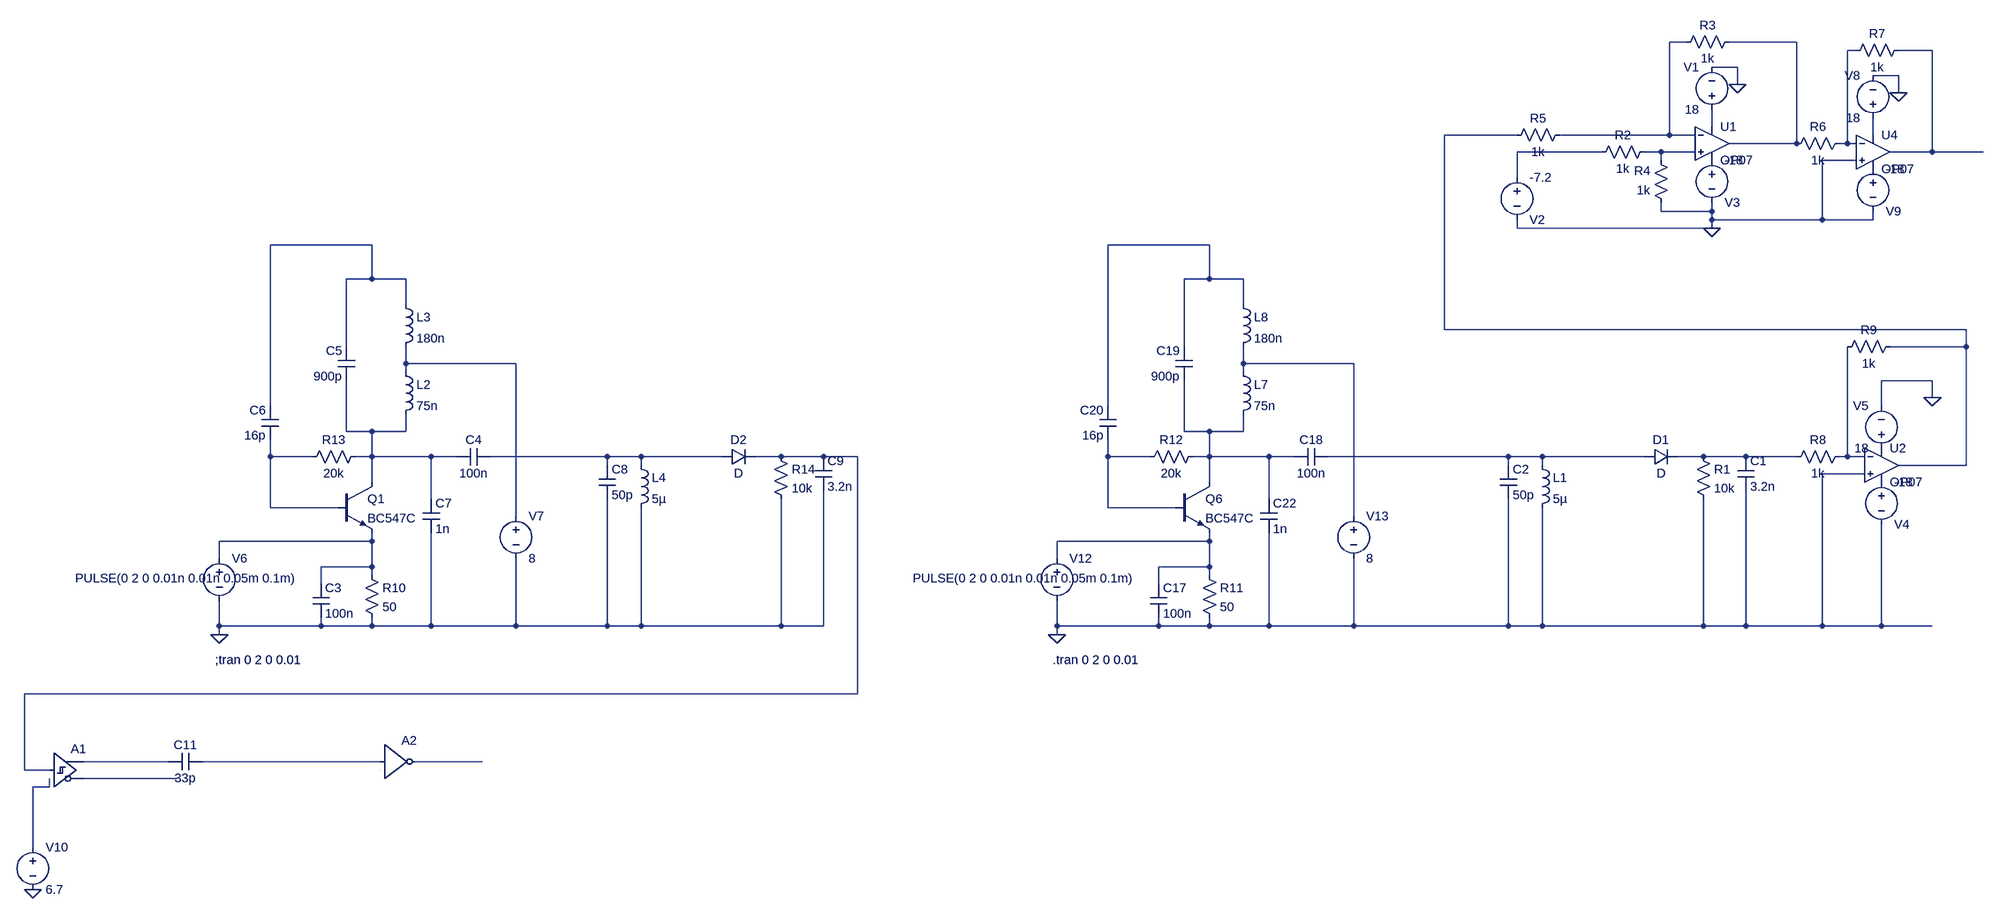
[diagram p0: schematic Empfaenger_Sender_Subtrahierer_Methode01und02.asc]
Empfaenger_Sender_Subtrahierer_Methode01und02.asc, the LTspice schematic file:
Version 4
SHEET 1 5860 1668
WIRE 1616 -80 1584 -80
WIRE 1824 -80 1696 -80
WIRE 1936 -64 1920 -64
WIRE 2080 -64 2016 -64
WIRE 1712 -32 1664 -32
WIRE 2016 -16 1968 -16
WIRE 1712 0 1712 -32
WIRE 2016 16 2016 -16
WIRE 1664 80 1664 48
WIRE 1296 96 1152 96
WIRE 1584 96 1584 -80
WIRE 1584 96 1376 96
WIRE 1632 96 1584 96
WIRE 1968 96 1968 64
WIRE 1824 112 1824 -80
WIRE 1824 112 1696 112
WIRE 1920 112 1920 -64
WIRE 1920 112 1904 112
WIRE 1936 112 1920 112
WIRE 1456 128 1296 128
WIRE 1568 128 1536 128
WIRE 1632 128 1568 128
WIRE 2080 128 2080 -64
WIRE 2080 128 2000 128
WIRE 2176 128 2080 128
WIRE 1568 144 1568 128
WIRE 1936 144 1872 144
WIRE 1296 176 1296 128
WIRE 1568 240 1568 224
WIRE 1664 240 1664 224
WIRE 1664 240 1568 240
WIRE 1664 256 1664 240
WIRE 1872 256 1872 144
WIRE 1872 256 1664 256
WIRE 1968 256 1968 240
WIRE 1968 256 1872 256
WIRE 1296 272 1296 256
WIRE 1664 272 1664 256
WIRE 1664 272 1296 272
WIRE -1712 304 -1904 304
WIRE 544 304 352 304
WIRE -1712 368 -1712 304
WIRE -1712 368 -1760 368
WIRE -1648 368 -1712 368
WIRE 544 368 544 304
WIRE 544 368 496 368
WIRE 608 368 544 368
WIRE -1648 416 -1648 368
WIRE 608 416 608 368
WIRE 1152 464 1152 96
WIRE 2144 464 1152 464
WIRE -1760 496 -1760 368
WIRE 496 496 496 368
WIRE 2144 496 2144 464
WIRE 2144 496 2000 496
WIRE -1648 528 -1648 496
WIRE -1440 528 -1648 528
WIRE 608 528 608 496
WIRE 816 528 608 528
WIRE -1648 544 -1648 528
WIRE 608 544 608 528
WIRE 2080 560 1984 560
WIRE 2080 592 2080 560
WIRE -1904 608 -1904 304
WIRE 352 608 352 304
WIRE 1984 608 1984 560
WIRE -1760 656 -1760 560
WIRE -1712 656 -1760 656
WIRE -1648 656 -1648 624
WIRE -1648 656 -1712 656
WIRE 496 656 496 560
WIRE 544 656 496 656
WIRE 608 656 608 624
WIRE 608 656 544 656
WIRE -1904 704 -1904 672
WIRE -1824 704 -1904 704
WIRE -1712 704 -1712 656
WIRE -1712 704 -1744 704
WIRE -1600 704 -1712 704
WIRE -1552 704 -1600 704
WIRE -976 704 -1488 704
WIRE -912 704 -976 704
WIRE -720 704 -912 704
WIRE -608 704 -656 704
WIRE -528 704 -608 704
WIRE -464 704 -528 704
WIRE 352 704 352 672
WIRE 432 704 352 704
WIRE 544 704 544 656
WIRE 544 704 512 704
WIRE 656 704 544 704
WIRE 704 704 656 704
WIRE 1280 704 768 704
WIRE 1344 704 1280 704
WIRE 1536 704 1344 704
WIRE 1648 704 1600 704
WIRE 1728 704 1648 704
WIRE 1824 704 1728 704
WIRE 1920 704 1920 496
WIRE 1920 704 1904 704
WIRE 1952 704 1920 704
WIRE -976 720 -976 704
WIRE -912 720 -912 704
WIRE 1280 720 1280 704
WIRE 1344 720 1344 704
WIRE 2144 720 2144 496
WIRE 2144 720 2016 720
WIRE 1952 736 1872 736
WIRE -1712 752 -1712 704
WIRE 544 752 544 704
WIRE -1600 784 -1600 704
WIRE 656 784 656 704
WIRE -1904 800 -1904 704
WIRE -1776 800 -1904 800
WIRE 352 800 352 704
WIRE 480 800 352 800
WIRE -1440 816 -1440 528
WIRE 816 816 816 528
WIRE -1712 864 -1712 848
WIRE -1712 864 -2000 864
WIRE 544 864 544 848
WIRE 544 864 256 864
WIRE -2000 896 -2000 864
WIRE 256 896 256 864
WIRE -1712 912 -1712 864
WIRE -1712 912 -1808 912
WIRE 544 912 544 864
WIRE 544 912 448 912
WIRE -1712 928 -1712 912
WIRE 544 928 544 912
WIRE -1808 944 -1808 912
WIRE 448 944 448 912
WIRE -2000 1024 -2000 976
WIRE -1808 1024 -1808 1008
WIRE -1808 1024 -2000 1024
WIRE -1712 1024 -1712 1008
WIRE -1712 1024 -1808 1024
WIRE -1600 1024 -1600 848
WIRE -1600 1024 -1712 1024
WIRE -1440 1024 -1440 896
WIRE -1440 1024 -1600 1024
WIRE -976 1024 -976 784
WIRE -976 1024 -1440 1024
WIRE -912 1024 -912 800
WIRE -912 1024 -976 1024
WIRE -608 1024 -608 784
WIRE -608 1024 -912 1024
WIRE -528 1024 -528 768
WIRE -528 1024 -608 1024
WIRE 256 1024 256 976
WIRE 448 1024 448 1008
WIRE 448 1024 256 1024
WIRE 544 1024 544 1008
WIRE 544 1024 448 1024
WIRE 656 1024 656 848
WIRE 656 1024 544 1024
WIRE 816 1024 816 896
WIRE 816 1024 656 1024
WIRE 1280 1024 1280 784
WIRE 1280 1024 816 1024
WIRE 1344 1024 1344 800
WIRE 1344 1024 1280 1024
WIRE 1648 1024 1648 784
WIRE 1648 1024 1344 1024
WIRE 1728 1024 1728 768
WIRE 1728 1024 1648 1024
WIRE 1872 1024 1872 736
WIRE 1872 1024 1728 1024
WIRE 1984 1024 1984 832
WIRE 1984 1024 1872 1024
WIRE 2080 1024 1984 1024
WIRE -2000 1040 -2000 1024
WIRE 256 1040 256 1024
WIRE -464 1152 -464 704
WIRE -464 1152 -2368 1152
WIRE -2096 1280 -2256 1280
WIRE -1696 1280 -2032 1280
WIRE -1504 1280 -1632 1280
WIRE -2368 1296 -2368 1152
WIRE -2320 1296 -2368 1296
WIRE -2080 1312 -2256 1312
WIRE -2320 1328 -2352 1328
WIRE -2352 1472 -2352 1328
FLAG 256 1040 0
FLAG 1712 0 0
FLAG 2080 592 0
FLAG 1664 272 0
FLAG 2016 16 0
FLAG -2000 1040 0
FLAG -2352 1552 0
SYMBOL res 528 912 R0
SYMATTR InstName R11
SYMATTR Value 50
SYMBOL cap 432 944 R0
SYMATTR InstName C17
SYMATTR Value 100n
SYMBOL res 528 688 R90
WINDOW 0 0 56 VBottom 2
WINDOW 3 32 56 VTop 2
SYMATTR InstName R12
SYMATTR Value 20k
SYMBOL cap 768 688 R90
WINDOW 0 0 32 VBottom 2
WINDOW 3 32 32 VTop 2
SYMATTR InstName C18
SYMATTR Value 100n
SYMBOL cap 512 560 R180
WINDOW 0 24 56 Left 2
WINDOW 3 24 8 Left 2
SYMATTR InstName C19
SYMATTR Value 900p
SYMBOL cap 368 672 R180
WINDOW 0 24 56 Left 2
WINDOW 3 24 8 Left 2
SYMATTR InstName C20
SYMATTR Value 16p
SYMBOL ind 592 528 R0
SYMATTR InstName L7
SYMATTR Value 75n
SYMBOL ind 592 400 R0
SYMATTR InstName L8
SYMATTR Value 180n
SYMBOL voltage 256 880 R0
WINDOW 123 0 0 Left 0
WINDOW 39 0 0 Left 0
WINDOW 3 -272 54 Left 2
SYMATTR Value PULSE(0 2 0 0.01n 0.01n 0.05m 0.1m)
SYMATTR InstName V12
SYMBOL voltage 816 800 R0
WINDOW 123 0 0 Left 0
WINDOW 39 0 0 Left 0
SYMATTR InstName V13
SYMATTR Value 8
SYMBOL npn 480 752 R0
SYMATTR InstName Q6
SYMATTR Value BC547C
SYMBOL cap 640 784 R0
SYMATTR InstName C22
SYMATTR Value 1n
SYMBOL diode 1536 720 R270
WINDOW 0 32 32 VTop 2
WINDOW 3 0 32 VBottom 2
SYMATTR InstName D1
SYMBOL cap 1264 720 R0
SYMATTR InstName C2
SYMATTR Value 50p
SYMBOL ind 1328 704 R0
SYMATTR InstName L1
SYMATTR Value 5µ
SYMBOL cap 1712 704 R0
SYMATTR InstName C1
SYMATTR Value 3.2n
SYMBOL res 1632 688 R0
SYMATTR InstName R1
SYMATTR Value 10k
SYMBOL voltage 1664 64 R180
WINDOW 0 24 96 Left 2
WINDOW 3 24 16 Left 2
WINDOW 123 0 0 Left 0
WINDOW 39 0 0 Left 0
SYMATTR InstName V1
SYMATTR Value 18
SYMBOL res 1712 -96 R90
WINDOW 0 0 56 VBottom 2
WINDOW 3 32 56 VTop 2
SYMATTR InstName R3
SYMATTR Value 1k
SYMBOL voltage 1664 128 R0
WINDOW 0 24 96 Left 2
WINDOW 3 24 16 Left 2
WINDOW 123 0 0 Left 0
WINDOW 39 0 0 Left 0
SYMATTR InstName V3
SYMATTR Value -18
SYMBOL Opamps\\OP07 1664 48 R0
SYMATTR InstName U1
SYMBOL res 1552 112 R90
WINDOW 0 0 56 VBottom 2
WINDOW 3 32 56 VTop 2
SYMATTR InstName R2
SYMATTR Value 1k
SYMBOL res 1584 240 R180
WINDOW 0 36 76 Left 2
WINDOW 3 36 40 Left 2
SYMATTR InstName R4
SYMATTR Value 1k
SYMBOL res 1280 112 R270
WINDOW 0 32 56 VTop 2
WINDOW 3 0 56 VBottom 2
SYMATTR InstName R5
SYMATTR Value 1k
SYMBOL voltage 1296 160 R0
WINDOW 0 24 96 Left 2
WINDOW 3 24 16 Left 2
WINDOW 123 0 0 Left 0
WINDOW 39 0 0 Left 0
SYMATTR InstName V2
SYMATTR Value -7.2
SYMBOL Opamps\\OP07 1984 656 R0
SYMATTR InstName U2
SYMBOL voltage 1984 736 R0
WINDOW 0 24 96 Left 2
WINDOW 3 24 16 Left 2
WINDOW 123 0 0 Left 0
WINDOW 39 0 0 Left 0
SYMATTR InstName V4
SYMATTR Value -18
SYMBOL voltage 1984 704 R180
WINDOW 0 24 96 Left 2
WINDOW 3 24 16 Left 2
WINDOW 123 0 0 Left 0
WINDOW 39 0 0 Left 0
SYMATTR InstName V5
SYMATTR Value 18
SYMBOL res 1920 688 R90
WINDOW 0 0 56 VBottom 2
WINDOW 3 32 56 VTop 2
SYMATTR InstName R8
SYMATTR Value 1k
SYMBOL res 2016 480 R90
WINDOW 0 0 56 VBottom 2
WINDOW 3 32 56 VTop 2
SYMATTR InstName R9
SYMATTR Value 1k
SYMBOL Opamps\\OP07 1968 64 R0
SYMATTR InstName U4
SYMBOL voltage 1968 80 R180
WINDOW 0 24 96 Left 2
WINDOW 3 24 16 Left 2
WINDOW 123 0 0 Left 0
WINDOW 39 0 0 Left 0
SYMATTR InstName V8
SYMATTR Value 18
SYMBOL voltage 1968 144 R0
WINDOW 0 24 96 Left 2
WINDOW 3 24 16 Left 2
WINDOW 123 0 0 Left 0
WINDOW 39 0 0 Left 0
SYMATTR InstName V9
SYMATTR Value -18
SYMBOL res 1920 96 R90
WINDOW 0 0 56 VBottom 2
WINDOW 3 32 56 VTop 2
SYMATTR InstName R6
SYMATTR Value 1k
SYMBOL res 2032 -80 R90
WINDOW 0 0 56 VBottom 2
WINDOW 3 32 56 VTop 2
SYMATTR InstName R7
SYMATTR Value 1k
SYMBOL res -1728 912 R0
SYMATTR InstName R10
SYMATTR Value 50
SYMBOL cap -1824 944 R0
SYMATTR InstName C3
SYMATTR Value 100n
SYMBOL res -1728 688 R90
WINDOW 0 0 56 VBottom 2
WINDOW 3 32 56 VTop 2
SYMATTR InstName R13
SYMATTR Value 20k
SYMBOL cap -1488 688 R90
WINDOW 0 0 32 VBottom 2
WINDOW 3 32 32 VTop 2
SYMATTR InstName C4
SYMATTR Value 100n
SYMBOL cap -1744 560 R180
WINDOW 0 24 56 Left 2
WINDOW 3 24 8 Left 2
SYMATTR InstName C5
SYMATTR Value 900p
SYMBOL cap -1888 672 R180
WINDOW 0 24 56 Left 2
WINDOW 3 24 8 Left 2
SYMATTR InstName C6
SYMATTR Value 16p
SYMBOL ind -1664 528 R0
SYMATTR InstName L2
SYMATTR Value 75n
SYMBOL ind -1664 400 R0
SYMATTR InstName L3
SYMATTR Value 180n
SYMBOL voltage -2000 880 R0
WINDOW 123 0 0 Left 0
WINDOW 39 0 0 Left 0
WINDOW 3 -272 54 Left 2
SYMATTR Value PULSE(0 2 0 0.01n 0.01n 0.05m 0.1m)
SYMATTR InstName V6
SYMBOL voltage -1440 800 R0
WINDOW 123 0 0 Left 0
WINDOW 39 0 0 Left 0
SYMATTR InstName V7
SYMATTR Value 8
SYMBOL npn -1776 752 R0
SYMATTR InstName Q1
SYMATTR Value BC547C
SYMBOL cap -1616 784 R0
SYMATTR InstName C7
SYMATTR Value 1n
SYMBOL diode -720 720 R270
WINDOW 0 32 32 VTop 2
WINDOW 3 0 32 VBottom 2
SYMATTR InstName D2
SYMBOL cap -992 720 R0
SYMATTR InstName C8
SYMATTR Value 50p
SYMBOL ind -928 704 R0
SYMATTR InstName L4
SYMATTR Value 5µ
SYMBOL cap -544 704 R0
SYMATTR InstName C9
SYMATTR Value 3.2n
SYMBOL res -624 688 R0
SYMATTR InstName R14
SYMATTR Value 10k
SYMBOL Digital\\schmitt -2320 1232 R0
SYMATTR InstName A1
SYMBOL voltage -2352 1456 R0
WINDOW 123 0 0 Left 0
WINDOW 39 0 0 Left 0
SYMATTR InstName V10
SYMATTR Value 6.7
SYMBOL cap -2032 1264 R90
WINDOW 0 0 32 VBottom 2
WINDOW 3 32 32 VTop 2
SYMATTR InstName C11
SYMATTR Value 33p
SYMBOL Digital\\inv -1696 1216 R0
SYMATTR InstName A2
TEXT 248 1088 Left 2 !.tran 0 2 0 0.01
TEXT -2008 1088 Left 2 !;tran 0 2 0 0.01

The netlist it stands for:
* Empfaenger_Sender_Subtrahierer_Methode01und02.asc
R11 N024 0 50
C17 N024 0 100n
R12 N015 N019 20k
C18 N020 N015 100n
C19 N015 N011 900p
C20 N019 N011 16p
L7 N013 N015 75n
L8 N011 N013 180n
V12 N024 0 PULSE(0 2 0 0.01n 0.01n 0.05m 0.1m)
V13 N013 0 8
Q6 N015 N019 N024 0 BC547C
C22 N015 0 1n
D1 N020 N021 D
C2 N020 0 50p
L1 N020 0 5µ
C1 N021 0 3.2n
R1 N021 0 10k
V1 N005 0 18
R3 N002 N001 1k
V3 P001 0 -18
XU1 N009 N001 N005 P001 N002 LT1001  ; OP07, pins In+ In- V+ V- OUT
R2 N009 N008 1k
R4 0 N009 1k
R5 N006 N001 1k
V2 N008 0 -7.2
XU2 0 N022 P002 P003 N006 LT1001  ; OP07, pins In+ In- V+ V- OUT
V4 P003 0 -18
V5 P002 0 18
R8 N022 N021 1k
R9 N006 N022 1k
XU4 0 N003 N007 P004 N004 LT1001  ; OP07, pins In+ In- V+ V- OUT
V8 N007 0 18
V9 P004 0 -18
R6 N003 N002 1k
R7 N004 N003 1k
R10 N023 0 50
C3 N023 0 100n
R13 N014 N016 20k
C4 N017 N014 100n
C5 N014 N010 900p
C6 N016 N010 16p
L2 N012 N014 75n
L3 N010 N012 180n
V6 N023 0 PULSE(0 2 0 0.01n 0.01n 0.05m 0.1m)
V7 N012 0 8
Q1 N014 N016 N023 0 BC547C
C7 N014 0 1n
D2 N017 N018 D
C8 N017 0 50p
L4 N017 0 5µ
C9 N018 0 3.2n
R14 N018 0 10k
A1 N018 N029 N029 N029 N029 N028 N025 N029 SCHMITT
V10 N029 0 6.7
C11 N026 N025 33p
A2 N026 0 0 0 0 N027 0 0 BUF
.model D D
.lib standard.dio
.model NPN NPN
.model PNP PNP
.lib standard.bjt
.tran 0 2 0 0.01
;tran 0 2 0 0.01
.lib LTC.lib
.backanno
.end